# Altium schematic sheet GPS.SchDoc: GPS
size 431 x 279 mm; DocumentNumber: 13; SheetNumber: 13; SheetTotal: 18; ENG_APP_DATE: --/--/--; DSN_APP_DATE: --/--/--; CHK_APP_DATE: --/--/--
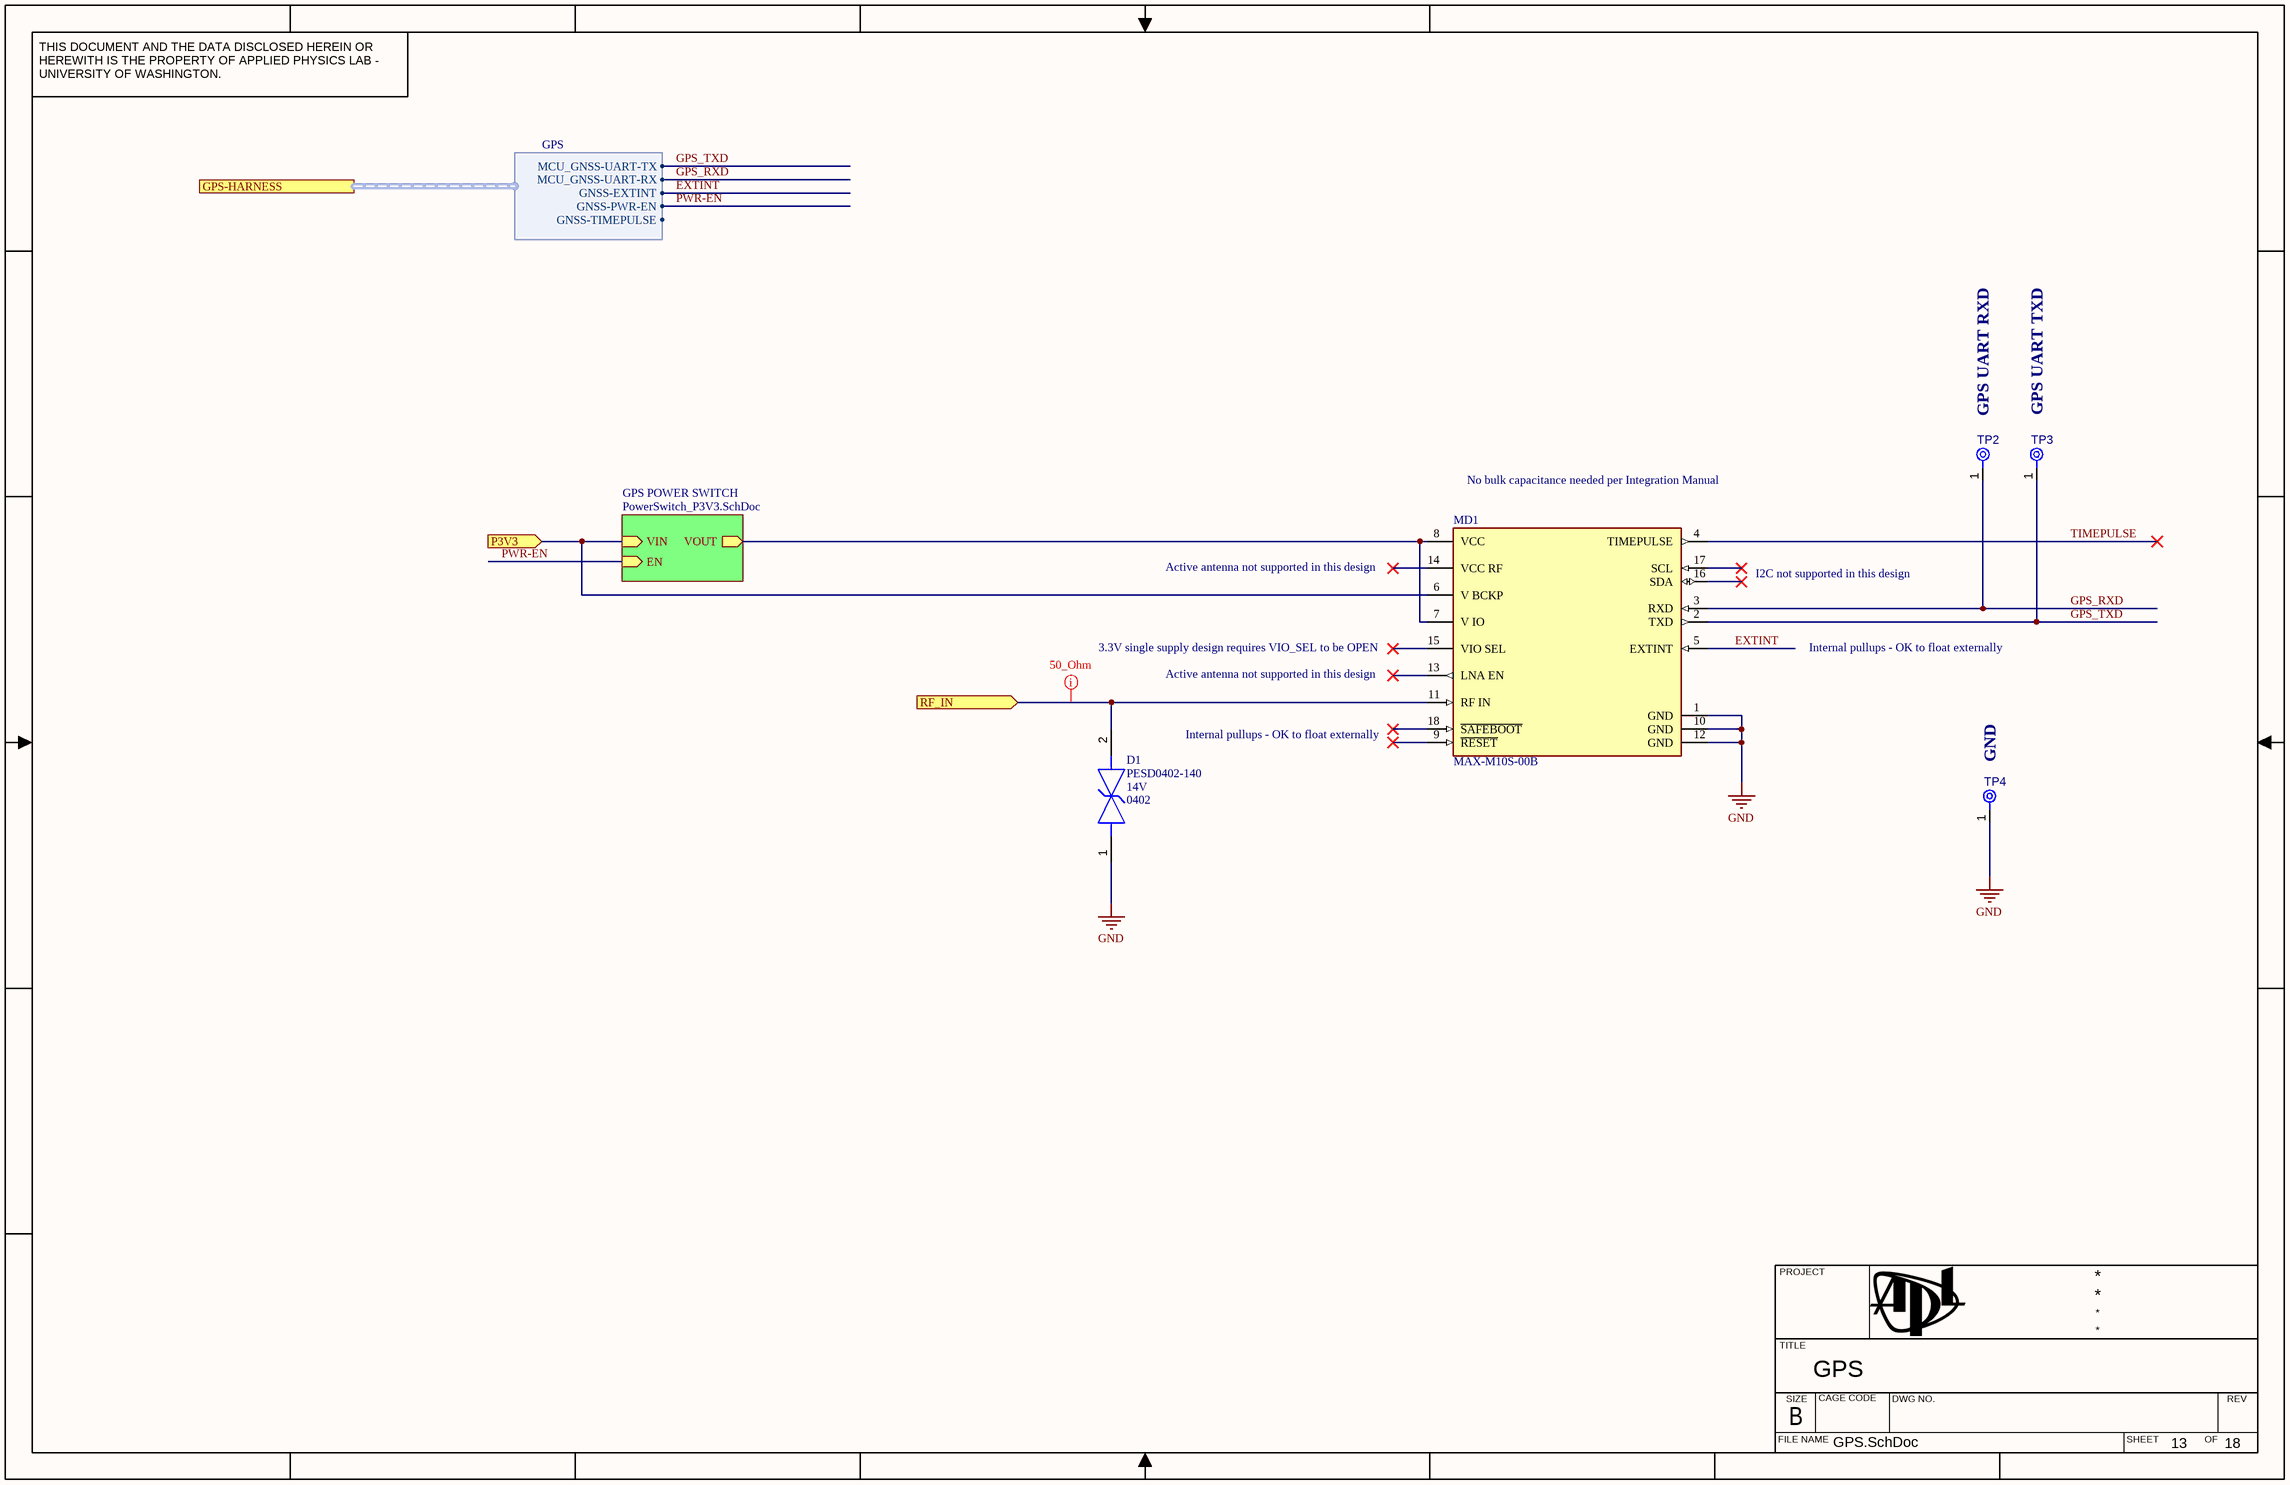
[diagram p0: GPS.SchDoc]

## Parts
D1  PESD0402-140  Reverse Standoff Voltage: 14V  Case/Package: 0402  [FP-PESD0402-MFG]
MD1  MAX-M10S-00B  [FP-MAX-M10S-00B-MFG]
TP2  TPAD6R-CIRCLED  [TP06R - Circled]  (value not drawn)  (no BOM)
TP3  TPAD6R-CIRCLED  [TP06R - Circled]  (value not drawn)  (no BOM)
TP4  TPAD6R-CIRCLED  [TP06R - Circled]  (value not drawn)  (no BOM)

## Sub-sheets
GPS POWER SWITCH = PowerSwitch_P3V3.SchDoc: VOUT (out), VIN (in), EN (in)

## Ports
GPS-HARNESS (harness GPS), P3V3 (in), RF_IN (in)

## Harnesses
GPS: MCU_GNSS-UART-RX, MCU_GNSS-UART-TX, GNSS-EXTINT, GNSS-PWR-EN, GNSS-TIMEPULSE

## Nets
GND: D1.1 MD1.1(GND) MD1.10(GND) MD1.12(GND) TP4.1(TP)
EXTINT: MD1.5(EXTINT) ; port GPS-HARNESS.GNSS-EXTINT
GPS_RXD: MD1.3(RXD) TP2.1(TP) ; port GPS-HARNESS.MCU_GNSS-UART-RX
GPS_TXD: MD1.2(TXD) TP3.1(TP) ; port GPS-HARNESS.MCU_GNSS-UART-TX
P3V3: MD1.6(V_BCKP) ; port P3V3, sheet GPS POWER SWITCH/VIN
PWR-EN: sheet GPS POWER SWITCH/EN, port GPS-HARNESS.GNSS-PWR-EN
RF_IN: D1.2 MD1.11(RF_IN) ; port RF_IN
TIMEPULSE: MD1.4(TIMEPULSE)
NetMD1_7: MD1.7(V_IO) MD1.8(VCC) ; sheet GPS POWER SWITCH/VOUT

Not connected (* = marked no-connect by the designer): MD1 9(~{RESET})* 13(LNA_EN)* 14(VCC_RF)* 15(VIO_SEL)* 16(SDA)* 17(SCL)* 18(~{SAFEBOOT})*

## Layout directives
net class 50_Ohm: RF_IN

## Notes on the sheet
- GPS UART RXD
- GPS UART TXD
- No bulk capacitance needed per Integration Manual
- (near MD1) Active antenna not supported in this design
- I2C not supported in this design
- (near MD1) 3.3V single supply design requires VIO_SEL to be OPEN
- Internal pullups - OK to float externally
- (near MD1) Internal pullups - OK to float externally
- GND
- THIS DOCUMENT AND THE DATA DISCLOSED HEREIN OR HEREWITH IS THE PROPERTY OF APPLIED PHYSICS LAB - UNIVERSITY OF WASHINGTON.
- PROJECT
- TITLE
- FILE NAME
- SIZE
- B
- CAGE CODE
- DWG NO.
- SHEET
- OF
- REV

## Library data of the parts
D1 = CMP-004-00062-2: TVS DIODE 14VWM 40VC 0402; Direction: Bidirectional; Clamping Voltage: 40V; Max Operating Temperature: 125°C; Mount: Surface Mount; Min Operating Temperature: -55°C
MD1 = CMP-010-00033-3: Gnss Lcc Rx, Rom, Tcxo, Lna, Saw; Case/Package: 18-SMD Module; Mount: Surface Mount
TP2-TP4 = CMP-00028-00014-3: 0.6mm round with a silkscreen circle.; Pins: 1